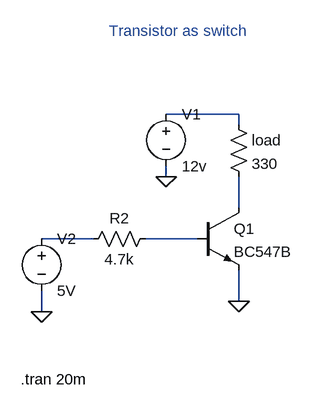
[diagram p0: schematic transitor as switch.asc]
transitor as switch.asc, the LTspice schematic file:
Version 4.1
SHEET 1 880 680
WIRE 208 -16 96 -16
WIRE 208 0 208 -16
WIRE 96 80 96 64
WIRE 208 128 208 80
WIRE -16 176 -96 176
WIRE 144 176 64 176
WIRE 208 272 208 224
WIRE -96 288 -96 256
FLAG 208 272 0
FLAG 96 80 0
FLAG -96 288 0
SYMBOL npn 144 128 R0
SYMATTR InstName Q1
SYMATTR Value BC547B
SYMBOL res 192 -16 R0
SYMATTR InstName load
SYMATTR Value 330
SYMBOL res -32 192 R270
WINDOW 0 32 56 VTop 2
WINDOW 3 0 56 VBottom 2
SYMATTR InstName R2
SYMATTR Value 4.7k
SYMBOL voltage 96 -32 R0
WINDOW 123 0 0 Left 0
WINDOW 39 0 0 Left 0
SYMATTR InstName V1
SYMATTR Value 12v
SYMBOL voltage -96 160 R0
SYMATTR InstName V2
SYMATTR Value 5V
TEXT -128 392 Left 2 !.tran 20m
TEXT 8 -144 Left 2 ;Transistor as switch

The netlist it stands for:
* transitor as switch.asc
Q1 N002 N004 0 0 BC547B
R§load N001 N002 330
R2 N003 N004 4.7k
V1 N001 0 12v
V2 N003 0 5V
.model NPN NPN
.model PNP PNP
.lib standard.bjt
.tran 20m
* Transistor as switch
.backanno
.end